# EAGLE design MumSchema (EAGLE 9.5.1)
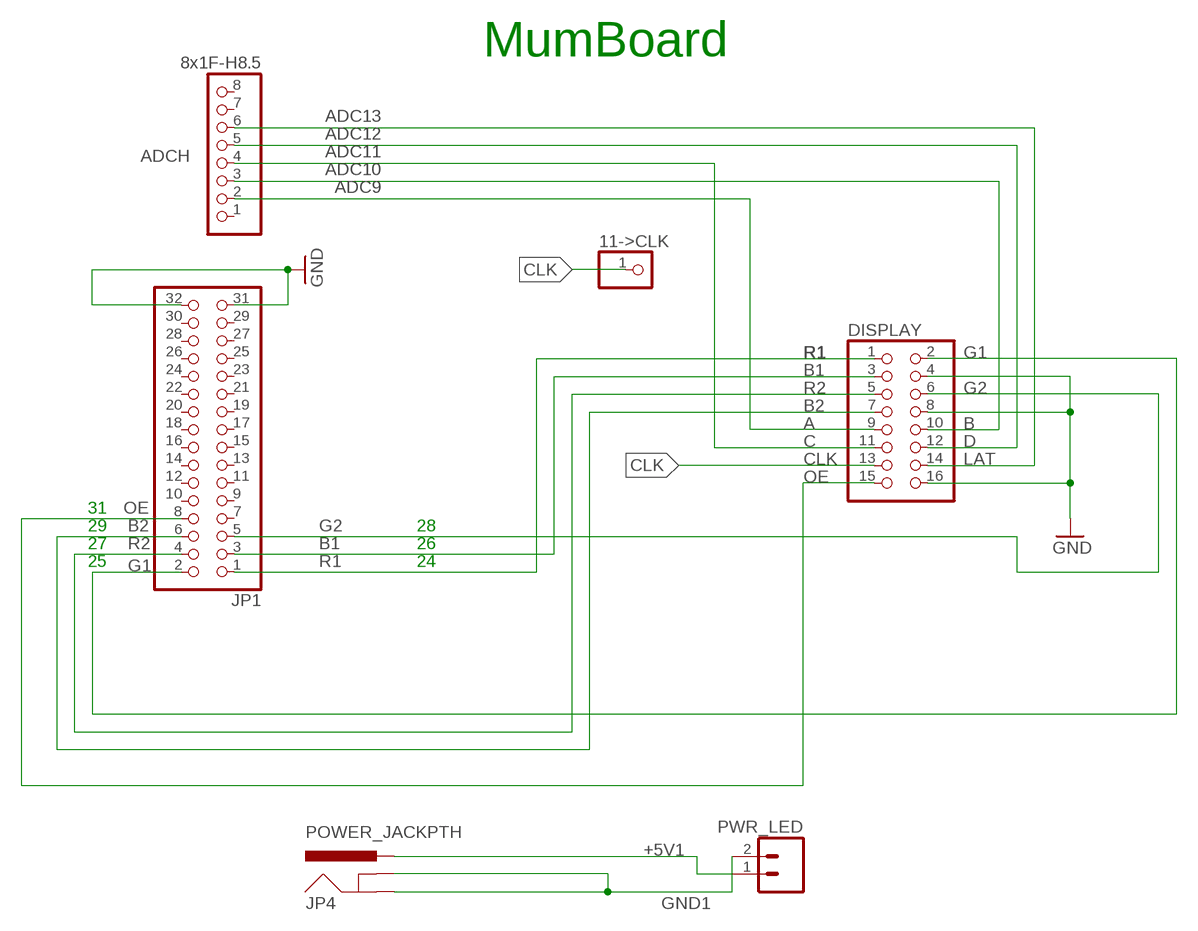
[diagram p0: schematic, sheet 1]

## Parts
11->CLK  PINHD-1X1  [1X01]
ADCH  8x1F-H8.5  PINHD-1X8  [1X08]
DISPLAY  PINHD-2X8  [2X08]
JP1  PINHD-2X16  [2X16]
JP4  POWER_JACKPTH  [POWER_JACK_PTH]
PWR_LED  M023.5MM  [SCREWTERMINAL-3.5MM-2]

## Nets
+5V1 [SUPPLYP]: JP4.PWR PWR_LED.1
A: ADCH.2 DISPLAY.9
B: ADCH.3 DISPLAY.10
B1: DISPLAY.3 JP1.3
B2: DISPLAY.7 JP1.6
C: ADCH.4 DISPLAY.11
CLK: 11->CLK.1 DISPLAY.13
D: ADCH.5 DISPLAY.12
G1: DISPLAY.2 JP1.2
G2: DISPLAY.6 JP1.5
GND [SUPPLYP]: DISPLAY.4 DISPLAY.8 DISPLAY.16 JP1.31 JP1.32
GND1 [SUPPLY]: JP4.GND JP4.GNDBREAK PWR_LED.2
LAT: ADCH.6 DISPLAY.14
OE: DISPLAY.15 JP1.8
R1: DISPLAY.1 JP1.1
R2: DISPLAY.5 JP1.4
Unconnected: ADCH.1 ADCH.7 ADCH.8 JP1.7 JP1.9 JP1.10 JP1.11 JP1.12 JP1.13 JP1.14 JP1.15 JP1.16 JP1.17 JP1.18 JP1.19 JP1.20 JP1.21 JP1.22 JP1.23 JP1.24 JP1.25 JP1.26 JP1.27 JP1.28 JP1.29 JP1.30

## Notes on the sheet
- MumBoard
- 31
- 29 | 28
- 27 | 26
- 25 | 24

## Library data of the parts
11->CLK = pinhead:PINHD-1X1: PIN HEADER
ADCH = SmartPrj:PINHD-1X8: PIN HEADER; SPICEPREFIX: A
DISPLAY = pinhead:PINHD-2X8: PIN HEADER
JP1 = pinhead:PINHD-2X16: PIN HEADER
JP4 = SparkFun-Connectors:POWER_JACK: Power Jack This is the standard 5.5mm barrel jack for power. The PTH is the most common, proven, reliable, footprint. The Slot footprint only works if the mill layer is transmitted to the PCB fab house so be warned. Mating wall wart : TOL-00298 (and others); PROD_ID: CONN-08197
PWR_LED = SparkFun-Connectors:M02: Standard 2-pin 0.1" header. Use with - straight break away headers ( PRT-00116) - right angle break away headers (PRT-00553) - swiss pins (PRT-00743) - machine pins (PRT-00117) - female headers (PRT-00115) Molex polarized connector foot print use with: PRT-08233 with associated crimp pins and housings. 2.54_SCREWTERM for use with PRT-10571. 3.5mm Screw Terminal footprints for PRT-08084 5mm Screw Terminal footprints for use with PRT-08432; PROD_ID: CONN-08399

## Net classes
0 default: width 0.305 mm, drill 0.508 mm, clearance 0.254 mm
1 SUPPLY: width 0.762 mm, drill 0.762 mm, clearance 0.254 mm to class 0, clearance 0.254 mm
2 SUPPLYP: width 0.762 mm, drill 0.762 mm, clearance 0.254 mm to class 0, clearance 0.254 mm to class 1, clearance 0.254 mm
3 power usb: width 0.508 mm, drill 0.406 mm, clearance 0.203 mm

## Board
Ardui'Mum Board by Perhan. To connect easily a RGB Led Matrix with a HUB75 to an Arduino Mega Board.
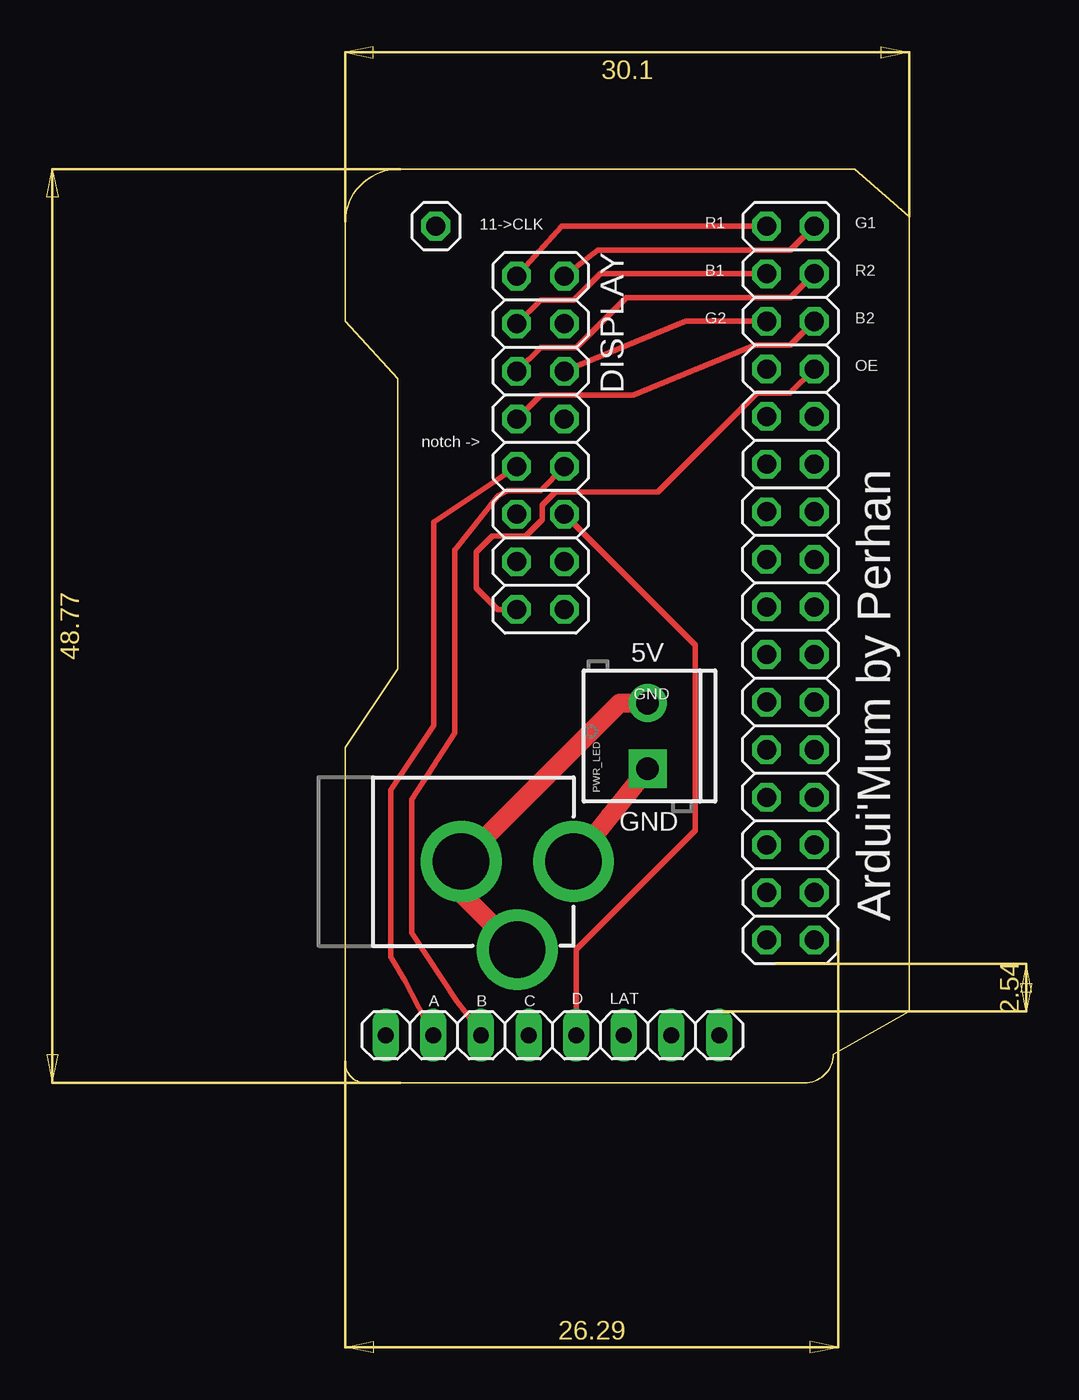
[diagram p1: board, top side]
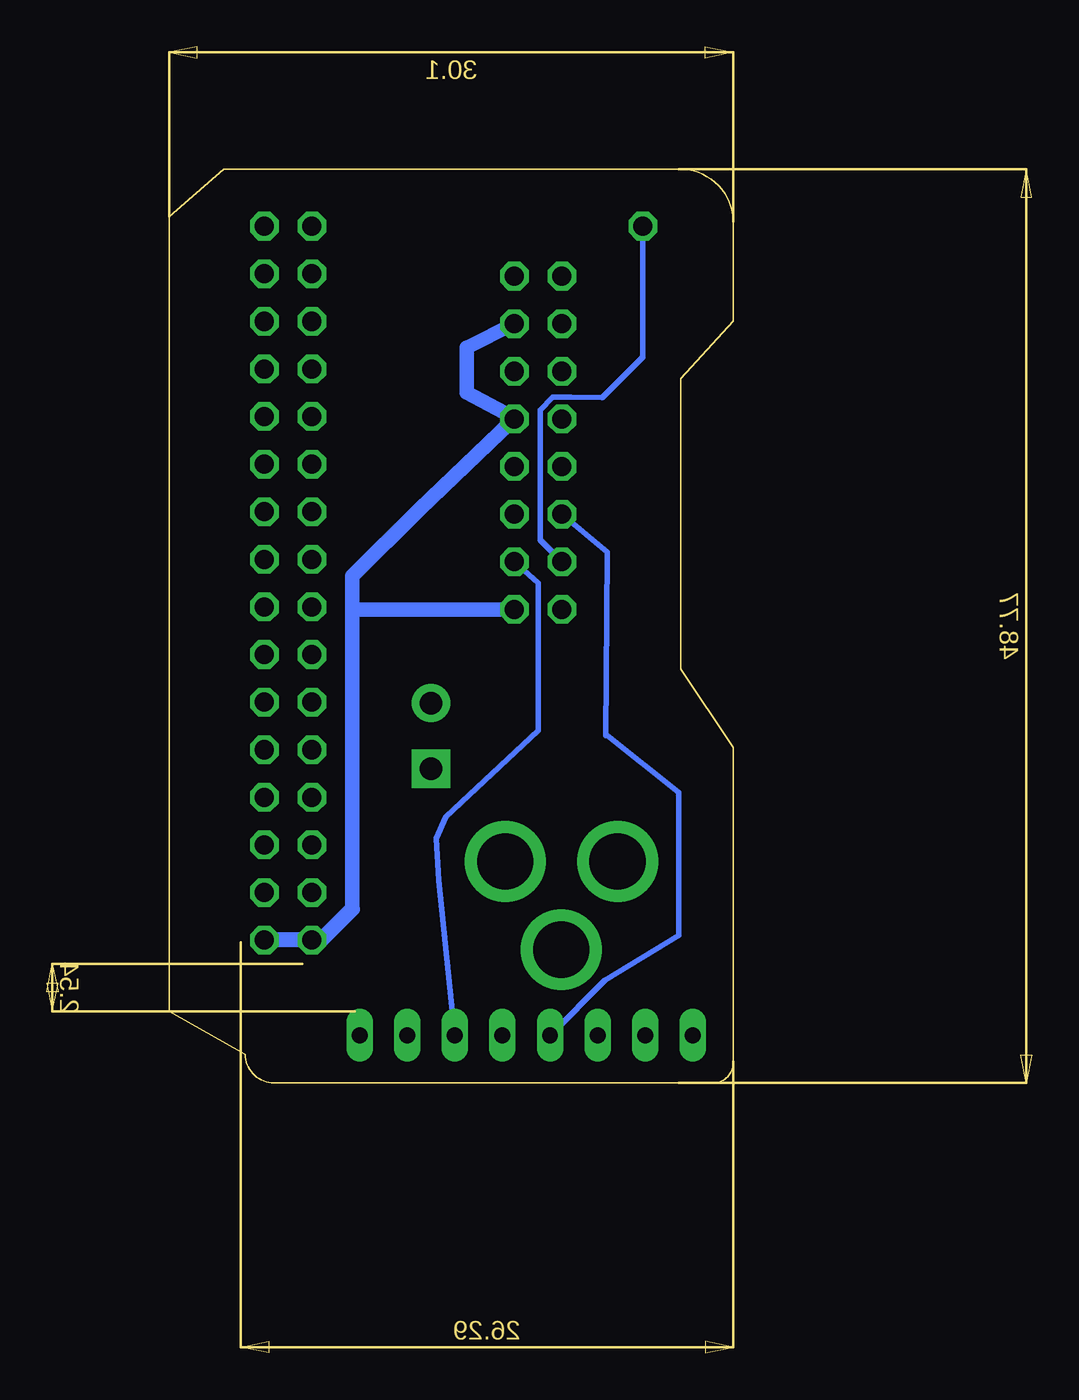
[diagram p2: board, bottom side, seen from below]

Size 30.1 x 48.77 mm. Coordinates in mm from the lower left corner, seen from the top.
Outline: 0,1.14 arc90 1.02,0 24.51,0 arc90 26.04,1.52 30.1,3.81 30.1,46.23 27.18,48.77 2.92,48.77 arc90 0,45.97 0,40.64 2.8,37.59 2.8,22.1 0,17.91 0,1.14
Copper layers (1*16): Top 0.035mm / dielectric 1.5mm / Bottom 0.035mm
Design rules "default": minimum track width 6mil, minimum drill 0.35mm, track to track 6mil, track to pad 6mil, pad to pad 6mil, via to via 6mil, smd to smd 6mil, copper to edge 40mil, drill to drill 6mil, minimum pad ring 10mil, minimum via ring 8mil, stop-mask expansion 4mil, vias tented up to drill 0mil, thermal gap 10mil

### Footprints (pad centres in the part's own frame; a part is rotated, then mirrored left to right if it is on the bottom)
1X01 = drill 1.016 octagon: 1 0,0
1X08 = drill 0.85 pad 1.422 long: 1 -8.89,0; 2 -6.35,0; 3 -3.81,0; 4 -1.27,0; 5 1.27,0; 6 3.81,0; 7 6.35,0; 8 8.89,0
2X08 = drill 1.016 octagon: 1 -8.89,-1.27; 2 -8.89,1.27; 3 -6.35,-1.27; 4 -6.35,1.27; 5 -3.81,-1.27; 6 -3.81,1.27; 7 -1.27,-1.27; 8 -1.27,1.27; 9 1.27,-1.27; 10 1.27,1.27; 11 3.81,-1.27; 12 3.81,1.27; 13 6.35,-1.27; 14 6.35,1.27; 15 8.89,-1.27; 16 8.89,1.27
2X16 = drill 1.016 octagon: 1 -19.05,-1.27; 2 -19.05,1.27; 3 -16.51,-1.27; 4 -16.51,1.27; 5 -13.97,-1.27; 6 -13.97,1.27; 7 -11.43,-1.27; 8 -11.43,1.27; 9 -8.89,-1.27; 10 -8.89,1.27; 11 -6.35,-1.27; 12 -6.35,1.27; 13 -3.81,-1.27; 14 -3.81,1.27; 15 -1.27,-1.27; 16 -1.27,1.27; 17 1.27,-1.27; 18 1.27,1.27; 19 3.81,-1.27; 20 3.81,1.27; 21 6.35,-1.27; 22 6.35,1.27; 23 8.89,-1.27; 24 8.89,1.27; 25 11.43,-1.27; 26 11.43,1.27; 27 13.97,-1.27; 28 13.97,1.27; 29 16.51,-1.27; 30 16.51,1.27; 31 19.05,-1.27; 32 19.05,1.27
POWER_JACK_PTH = drill 2.997 pad 4.318: GND 0,7.7; GNDBREAK 4.7,10.7; PWR 0,13.7
SCREWTERMINAL-3.5MM-2 = drill 1.2 pad 2.032 square: 1 0,0 | drill 1.2 pad 2.032: 2 3.5,0

### Placement (x,y rotation side)
11->CLK  4.83,45.72 0 top
ADCH  11.05,2.54 0 top
DISPLAY  10.42,34.16 270 top
JP1  23.75,26.67 270 top
JP4  -1.52,11.81 270 top
PWR_LED  16.13,16.76 90 top

### Tracks (layer width: path | path; a pad name or v marks a point on that pad's centre or on a via)
+5V1
  Top 1.016: JP4.PWR 14.1,14.22 PWR_LED.1
A
  Top 0.305: ADCH.2 3.18,5.46 2.41,6.73 2.41,15.62 4.73,19.07 4.73,29.93 7.92,32.07 DISPLAY.9
B
  Top 0.305: ADCH.3 6.48,3.68 5.97,4.32 3.56,8 3.56,15.11 5.84,18.67 5.84,28.43 5.88,28.47 8.13,31.32 8.64,31.62 10.42,31.62 DISPLAY.10
B1
  Top 0.305: DISPLAY.3 10.42,41.78 12.19,41.78 13.59,43.18 JP1.3
B2
  Top 0.305: DISPLAY.7 10.42,36.7 15.37,36.7 21.85,39.37 23.75,39.37 JP1.6
C
  Bottom 0.305: DISPLAY.11 6.73,28.32 6.76,24.9 6.81,18.55 6.73,18.54 2.92,15.49 2.92,7.87 6.87,5.48 ADCH.4
CLK
  Bottom 0.305: 11->CLK.1 4.83,38.73 6.99,36.58 8.66,36.6 9.63,36.6 10.31,35.92 10.31,28.98 DISPLAY.13
D
  Top 0.305: ADCH.5 12.32,7.11 18.67,13.46 18.67,23.37 DISPLAY.12
G1
  Top 0.305: DISPLAY.2 13.46,44.45 23.75,44.45 JP1.2
G2
  Top 0.305: DISPLAY.6 11.94,38.1 18.16,40.64 JP1.5
GND
  Bottom 0.762: DISPLAY.4 14.23,39.24 14.23,36.83 11.81,35.56 DISPLAY.8 11.81,35.31 16.77,30.61 20.32,27.05 20.32,25.27 | 20.32,25.27 DISPLAY.16 | 20.32,25.27 20.32,9.27
  Bottom 0.813: 20.32,9.27 21.97,7.62 JP1.31 JP1.32
GND1
  Top 1.016: JP4.GNDBREAK 6.18,10.11 JP4.GND 14.63,20.26 PWR_LED.2
LAT
  Bottom 0.305: ADCH.6 15.72,10.8 15.85,13.04 15.34,14.18 10.42,18.82 10.42,26.67 DISPLAY.14
OE
  Top 0.305: DISPLAY.15 8.13,25.27 6.99,26.42 6.99,28.32 7.85,29.18 9.63,29.18 10.52,30.07 10.52,30.84 11.2,31.52 16.68,31.52 21.96,36.8 23.73,36.8 JP1.8
R1
  Top 0.305: DISPLAY.1 11.56,45.72 JP1.1
R2
  Top 0.305: DISPLAY.5 10.42,39.24 12.32,39.24 14.99,41.91 23.75,41.91 JP1.4

### Text on the board
tNames: R1 | G1 | B1 | R2 | G2 | B2 | OE | notch -> | 5V | GND | GND | Ardui'Mum by Perhan | A | B | C | D | LAT